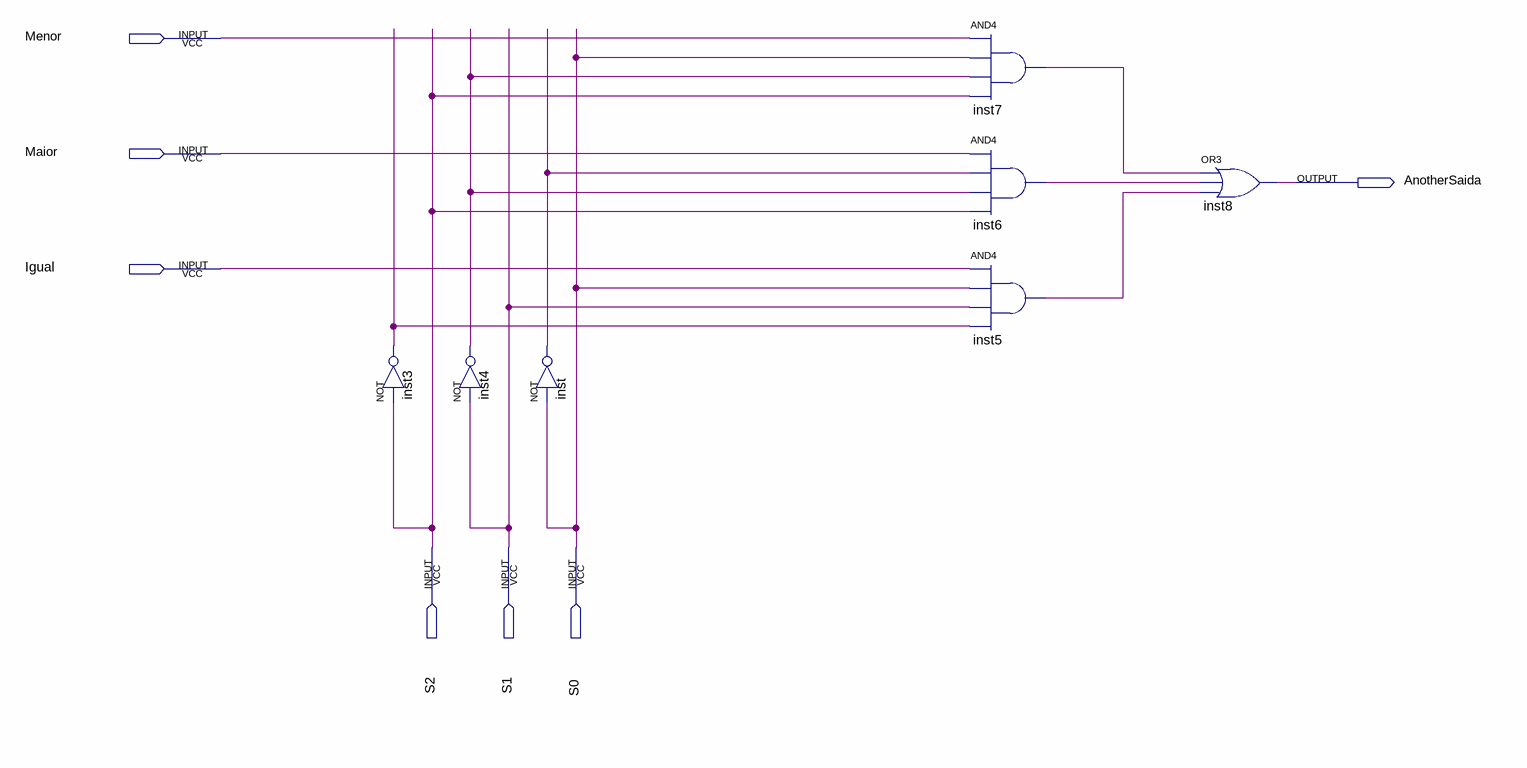
[diagram p0: schematic sheet]
// Quartus schematic Mux3to1.bdf as structural Verilog: 7 symbols, 7 pins
module Mux3to1 (
  input  Menor,
  input  Maior,
  input  Igual,
  input  S2,
  input  S1,
  input  S0,
  output AnotherSaida
);

  wire inst3_out, inst4_out, inst5_out, inst6_out, inst7_out, inst_out;

  not inst3 (inst3_out, S2);
  not inst4 (inst4_out, S1);
  not inst (inst_out, S0);
  and inst7 (inst7_out, Menor, S0, inst4_out, S2);
  and inst6 (inst6_out, Maior, inst_out, inst4_out, S2);
  and inst5 (inst5_out, Igual, S0, S1, inst3_out);
  or inst8 (AnotherSaida, inst7_out, inst6_out, inst5_out);
endmodule
